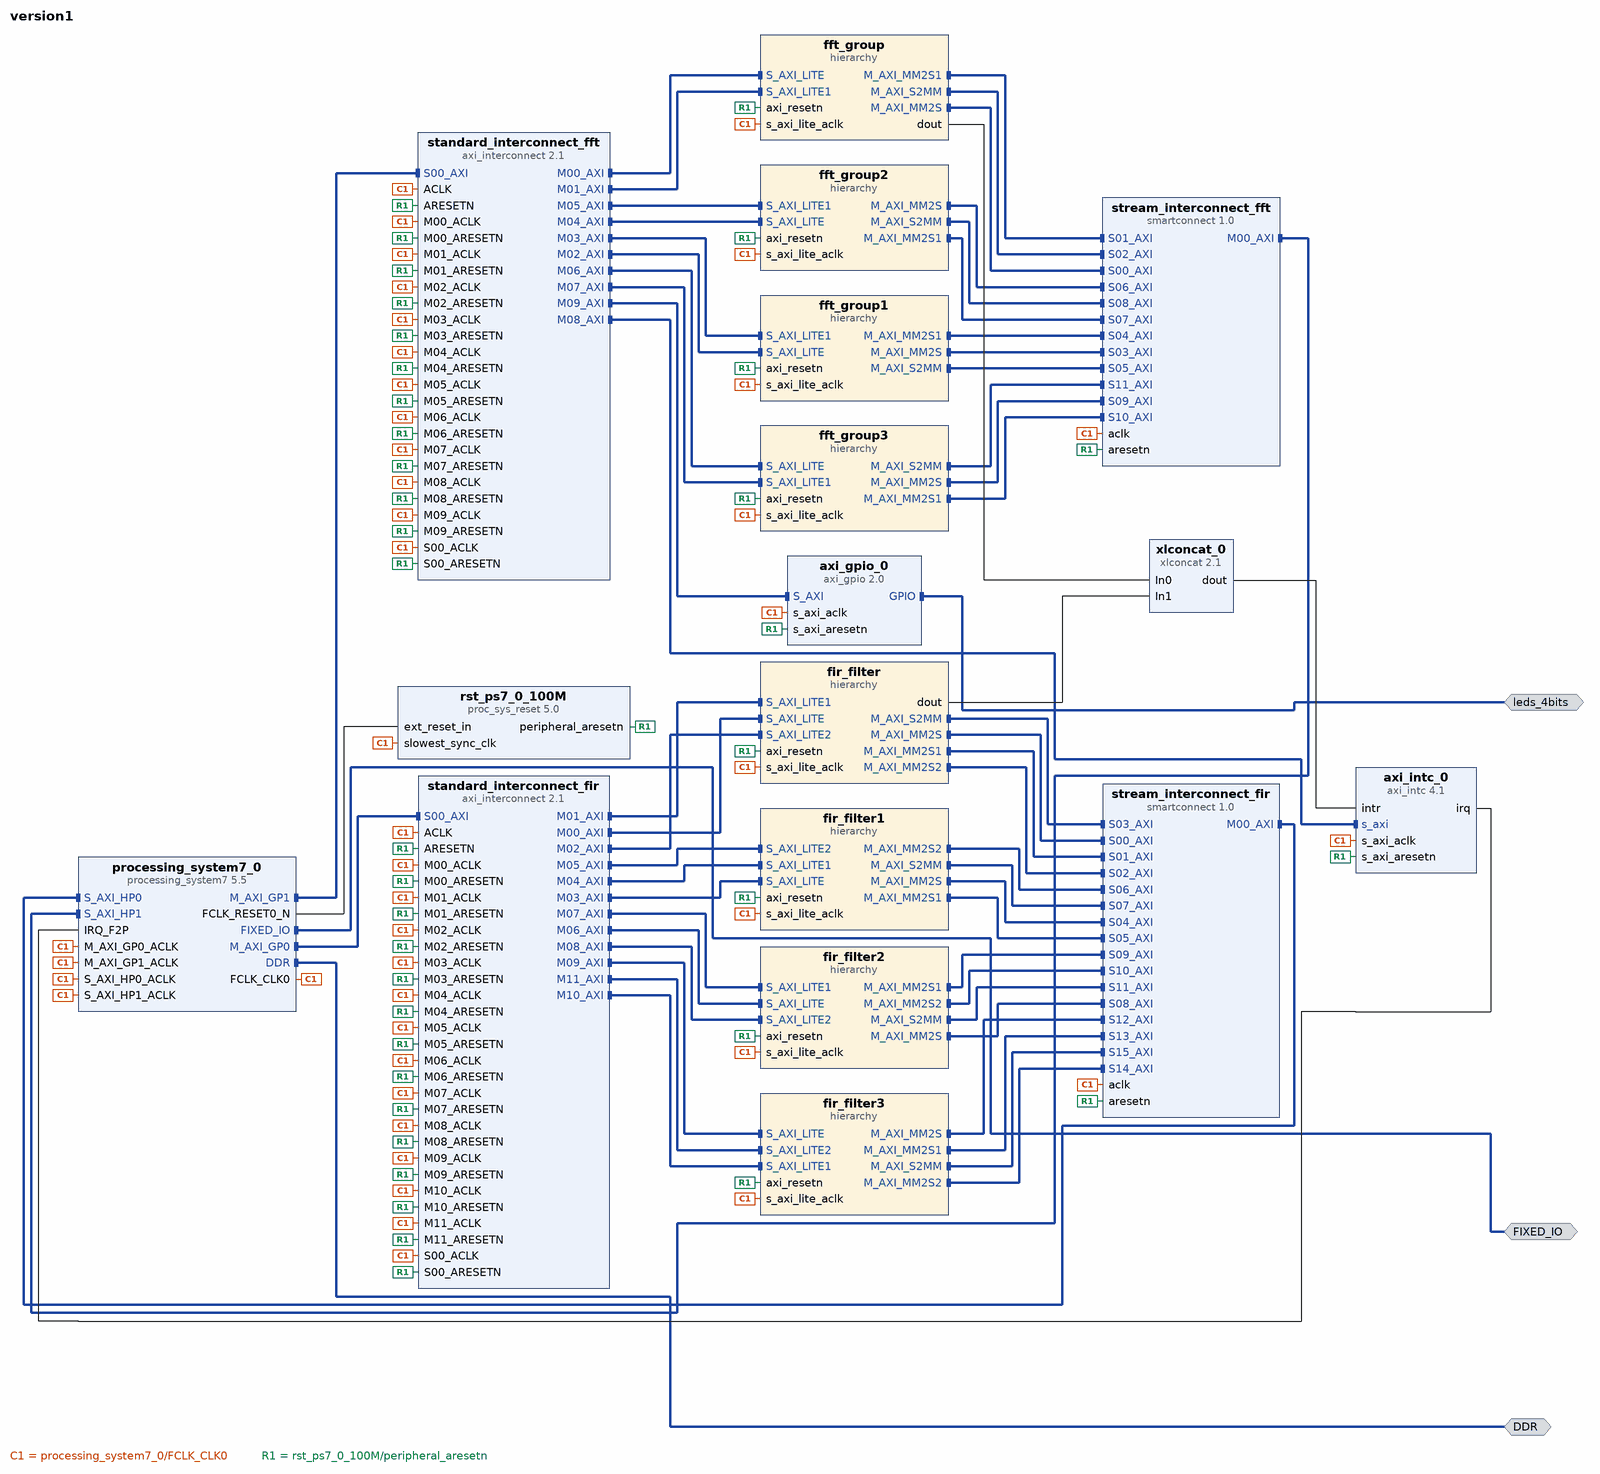
[diagram p0: block diagram of the top level]
# Vivado block design version1, xc7z020clg400-1, Vivado 2019.1
create_bd_design version1

create_bd_intf_port -mode Master -vlnv xilinx.com:interface:ddrx_rtl:1.0 DDR
create_bd_intf_port -mode Master -vlnv xilinx.com:display_processing_system7:fixedio_rtl:1.0 FIXED_IO
create_bd_intf_port -mode Master -vlnv xilinx.com:interface:gpio_rtl:1.0 leds_4bits

create_bd_cell -type ip -vlnv xilinx.com:ip:axi_gpio:2.0 axi_gpio_0
set_property -dict [list \
  CONFIG.C_IS_DUAL 0 \
  CONFIG.GPIO_BOARD_INTERFACE leds_4bits \
  CONFIG.USE_BOARD_FLOW true \
] [get_bd_cells axi_gpio_0]
create_bd_cell -type ip -vlnv xilinx.com:ip:axi_intc:4.1 axi_intc_0
create_bd_cell -type hier fft_group
create_bd_cell -type hier fir_filter
create_bd_cell -type ip -vlnv xilinx.com:ip:processing_system7:5.5 processing_system7_0
set_property -dict [list \
  CONFIG.PCW_APU_PERIPHERAL_FREQMHZ 650 \
  CONFIG.PCW_CRYSTAL_PERIPHERAL_FREQMHZ 50 \
  CONFIG.PCW_ENET0_ENET0_IO {MIO 16 .. 27} \
  CONFIG.PCW_ENET0_GRP_MDIO_ENABLE 1 \
  CONFIG.PCW_ENET0_GRP_MDIO_IO {MIO 52 .. 53} \
  CONFIG.PCW_ENET0_PERIPHERAL_ENABLE 1 \
  CONFIG.PCW_ENET0_RESET_ENABLE 1 \
  CONFIG.PCW_ENET0_RESET_IO {MIO 9} \
  CONFIG.PCW_ENET_RESET_ENABLE 1 \
  CONFIG.PCW_ENET_RESET_SELECT {Share reset pin} \
  CONFIG.PCW_FPGA0_PERIPHERAL_FREQMHZ 100 \
  CONFIG.PCW_FPGA1_PERIPHERAL_FREQMHZ 50 \
  CONFIG.PCW_GPIO_MIO_GPIO_ENABLE 1 \
  CONFIG.PCW_GPIO_MIO_GPIO_IO MIO \
  CONFIG.PCW_I2C_RESET_ENABLE 1 \
  CONFIG.PCW_IRQ_F2P_INTR 1 \
  CONFIG.PCW_PERIPHERAL_BOARD_PRESET part0 \
  CONFIG.PCW_PRESET_BANK1_VOLTAGE {LVCMOS 1.8V} \
  CONFIG.PCW_QSPI_GRP_FBCLK_ENABLE 1 \
  CONFIG.PCW_QSPI_GRP_FBCLK_IO {MIO 8} \
  CONFIG.PCW_QSPI_GRP_SINGLE_SS_ENABLE 1 \
  CONFIG.PCW_QSPI_GRP_SINGLE_SS_IO {MIO 1 .. 6} \
  CONFIG.PCW_QSPI_PERIPHERAL_ENABLE 1 \
  CONFIG.PCW_QSPI_QSPI_IO {MIO 1 .. 6} \
  CONFIG.PCW_SD0_GRP_CD_ENABLE 1 \
  CONFIG.PCW_SD0_GRP_CD_IO {MIO 47} \
  CONFIG.PCW_SD0_GRP_WP_ENABLE 0 \
  CONFIG.PCW_SD0_PERIPHERAL_ENABLE 1 \
  CONFIG.PCW_SD0_SD0_IO {MIO 40 .. 45} \
  CONFIG.PCW_SDIO_PERIPHERAL_FREQMHZ 50 \
  CONFIG.PCW_SINGLE_QSPI_DATA_MODE x4 \
  CONFIG.PCW_UART0_PERIPHERAL_ENABLE 1 \
  CONFIG.PCW_UART0_UART0_IO {MIO 14 .. 15} \
  CONFIG.PCW_UART1_PERIPHERAL_ENABLE 0 \
  CONFIG.PCW_UART_PERIPHERAL_FREQMHZ 100 \
  CONFIG.PCW_UIPARAM_DDR_BUS_WIDTH {16 Bit} \
  CONFIG.PCW_UIPARAM_DDR_FREQ_MHZ 525 \
  CONFIG.PCW_UIPARAM_DDR_PARTNO {MT41J256M16 RE-125} \
  CONFIG.PCW_USB0_PERIPHERAL_ENABLE 1 \
  CONFIG.PCW_USB0_RESET_ENABLE 1 \
  CONFIG.PCW_USB0_RESET_IO {MIO 46} \
  CONFIG.PCW_USB0_USB0_IO {MIO 28 .. 39} \
  CONFIG.PCW_USB_RESET_ENABLE 1 \
  CONFIG.PCW_USB_RESET_SELECT {Share reset pin} \
  CONFIG.PCW_USE_FABRIC_INTERRUPT 1 \
  CONFIG.PCW_USE_M_AXI_GP1 1 \
  CONFIG.PCW_USE_S_AXI_HP0 1 \
  CONFIG.PCW_USE_S_AXI_HP1 1 \
] [get_bd_cells processing_system7_0]
# 506 more settings of processing_system7_0 are not shown: defaults, MIO pin electricals, DDR timing, and values the tool derives
create_bd_cell -type ip -vlnv xilinx.com:ip:proc_sys_reset:5.0 rst_ps7_0_100M
create_bd_cell -type ip -vlnv xilinx.com:ip:axi_interconnect:2.1 standard_interconnect_fir
set_property -dict {CONFIG.NUM_MI 12} [get_bd_cells standard_interconnect_fir]
create_bd_cell -type ip -vlnv xilinx.com:ip:smartconnect:1.0 stream_interconnect_fir
set_property -dict {CONFIG.NUM_SI 16} [get_bd_cells stream_interconnect_fir]
create_bd_cell -type ip -vlnv xilinx.com:ip:xlconcat:2.1 xlconcat_0
create_bd_cell -type hier fft_group1
create_bd_cell -type hier fir_filter1
create_bd_cell -type hier fft_group2
create_bd_cell -type hier fir_filter2
create_bd_cell -type hier fft_group3
create_bd_cell -type hier fir_filter3
create_bd_cell -type ip -vlnv xilinx.com:ip:axi_interconnect:2.1 standard_interconnect_fft
set_property -dict {CONFIG.NUM_MI 10} [get_bd_cells standard_interconnect_fft]
create_bd_cell -type ip -vlnv xilinx.com:ip:smartconnect:1.0 stream_interconnect_fft
set_property -dict {CONFIG.NUM_SI 12} [get_bd_cells stream_interconnect_fft]

# ---- hierarchy /fft_group ----
current_bd_instance /fft_group
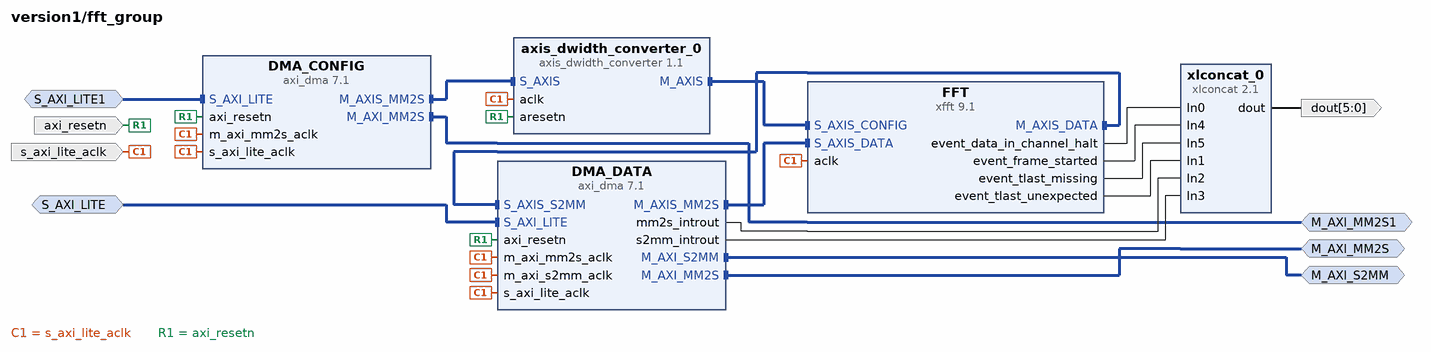
[diagram p1: block diagram inside /fft_group]
create_bd_intf_pin -mode Master -vlnv xilinx.com:interface:aximm_rtl:1.0 M_AXI_MM2S
create_bd_intf_pin -mode Master -vlnv xilinx.com:interface:aximm_rtl:1.0 M_AXI_MM2S1
create_bd_intf_pin -mode Master -vlnv xilinx.com:interface:aximm_rtl:1.0 M_AXI_S2MM
create_bd_intf_pin -mode Slave -vlnv xilinx.com:interface:aximm_rtl:1.0 S_AXI_LITE
create_bd_intf_pin -mode Slave -vlnv xilinx.com:interface:aximm_rtl:1.0 S_AXI_LITE1
create_bd_pin -dir I -type rst axi_resetn
create_bd_pin -dir O -from 5 -to 0 dout
create_bd_pin -dir I -type clk s_axi_lite_aclk

create_bd_cell -type ip -vlnv xilinx.com:ip:axi_dma:7.1 DMA_CONFIG
set_property -dict [list \
  CONFIG.c_include_mm2s 1 \
  CONFIG.c_include_s2mm 0 \
  CONFIG.c_include_sg 0 \
  CONFIG.c_m_axis_mm2s_tdata_width 32 \
  CONFIG.c_micro_dma 0 \
  CONFIG.c_mm2s_burst_size 32 \
  CONFIG.c_sg_length_width 14 \
] [get_bd_cells DMA_CONFIG]
create_bd_cell -type ip -vlnv xilinx.com:ip:axi_dma:7.1 DMA_DATA
set_property -dict [list \
  CONFIG.c_include_mm2s 1 \
  CONFIG.c_include_sg 0 \
  CONFIG.c_m_axi_mm2s_data_width 64 \
  CONFIG.c_m_axis_mm2s_tdata_width 64 \
  CONFIG.c_mm2s_burst_size 8 \
  CONFIG.c_sg_length_width 14 \
] [get_bd_cells DMA_DATA]
create_bd_cell -type ip -vlnv xilinx.com:ip:xfft:9.1 FFT
set_property -dict [list \
  CONFIG.butterfly_type use_xtremedsp_slices \
  CONFIG.channels 1 \
  CONFIG.complex_mult_type use_mults_resources \
  CONFIG.cyclic_prefix_insertion false \
  CONFIG.data_format fixed_point \
  CONFIG.implementation_options radix_4_burst_io \
  CONFIG.input_width 32 \
  CONFIG.number_of_stages_using_block_ram_for_data_and_phase_factors 0 \
  CONFIG.output_ordering natural_order \
  CONFIG.run_time_configurable_transform_length true \
  CONFIG.target_clock_frequency 100 \
  CONFIG.target_data_throughput 50 \
  CONFIG.throttle_scheme nonrealtime \
  CONFIG.transform_length 2048 \
] [get_bd_cells FFT]
create_bd_cell -type ip -vlnv xilinx.com:ip:axis_dwidth_converter:1.1 axis_dwidth_converter_0
set_property -dict {CONFIG.M_TDATA_NUM_BYTES 3} [get_bd_cells axis_dwidth_converter_0]
create_bd_cell -type ip -vlnv xilinx.com:ip:xlconcat:2.1 xlconcat_0
set_property -dict {CONFIG.NUM_PORTS 6} [get_bd_cells xlconcat_0]

# ---- hierarchy /fir_filter ----
current_bd_instance /fir_filter
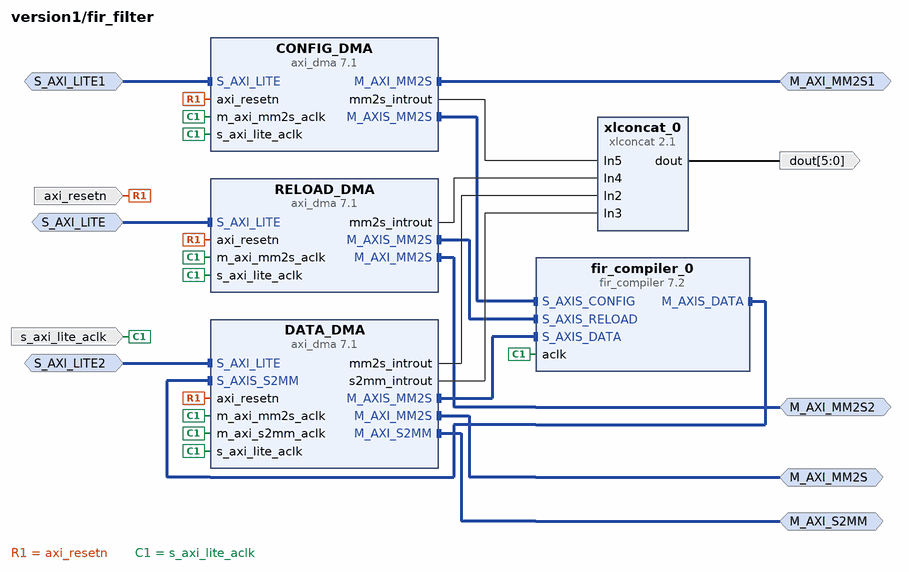
[diagram p2: block diagram inside /fir_filter]
create_bd_intf_pin -mode Master -vlnv xilinx.com:interface:aximm_rtl:1.0 M_AXI_MM2S
create_bd_intf_pin -mode Master -vlnv xilinx.com:interface:aximm_rtl:1.0 M_AXI_MM2S1
create_bd_intf_pin -mode Master -vlnv xilinx.com:interface:aximm_rtl:1.0 M_AXI_MM2S2
create_bd_intf_pin -mode Master -vlnv xilinx.com:interface:aximm_rtl:1.0 M_AXI_S2MM
create_bd_intf_pin -mode Slave -vlnv xilinx.com:interface:aximm_rtl:1.0 S_AXI_LITE
create_bd_intf_pin -mode Slave -vlnv xilinx.com:interface:aximm_rtl:1.0 S_AXI_LITE1
create_bd_intf_pin -mode Slave -vlnv xilinx.com:interface:aximm_rtl:1.0 S_AXI_LITE2
create_bd_pin -dir I -type rst axi_resetn
create_bd_pin -dir O -from 5 -to 0 dout
create_bd_pin -dir I -type clk s_axi_lite_aclk

create_bd_cell -type ip -vlnv xilinx.com:ip:axi_dma:7.1 CONFIG_DMA
set_property -dict [list \
  CONFIG.c_include_mm2s 1 \
  CONFIG.c_include_s2mm 0 \
  CONFIG.c_include_sg 0 \
  CONFIG.c_m_axis_mm2s_tdata_width 8 \
] [get_bd_cells CONFIG_DMA]
create_bd_cell -type ip -vlnv xilinx.com:ip:axi_dma:7.1 DATA_DMA
set_property -dict [list \
  CONFIG.c_include_mm2s 1 \
  CONFIG.c_include_sg 0 \
  CONFIG.c_m_axi_mm2s_data_width 32 \
  CONFIG.c_m_axis_mm2s_tdata_width 32 \
  CONFIG.c_mm2s_burst_size 16 \
  CONFIG.c_sg_length_width 26 \
] [get_bd_cells DATA_DMA]
create_bd_cell -type ip -vlnv xilinx.com:ip:axi_dma:7.1 RELOAD_DMA
set_property -dict [list \
  CONFIG.c_include_mm2s 1 \
  CONFIG.c_include_s2mm 0 \
  CONFIG.c_include_sg 0 \
  CONFIG.c_m_axis_mm2s_tdata_width 16 \
] [get_bd_cells RELOAD_DMA]
create_bd_cell -type ip -vlnv xilinx.com:ip:fir_compiler:7.2 fir_compiler_0
set_property -dict [list \
  CONFIG.Clock_Frequency 100 \
  CONFIG.CoefficientVector {-169, -314, -507, -43, 807, 1195, 677, -195, -495, -126, 121, -191, -539, -376, -17, -46, -324, -285, 63, 172, -57, -117, 178, 359, 157, -9, 203, 422, 240, -35, 70, 314, 172, -189, -195, 83, 33, -364, -463, -133, -27, -391, -570, -188, 119, -159, -428, -45, 457, 287, -122, 154, 798, 734, 114, 141, 851, 914, 38, -332, 392, 684, -421, -1332, -601, 190, -1023, -2736, -2002, -15, -1039, -4748, -4549, 3141, 11762, 11762, 3141, -4549, -4748, -1039, -15, -2002, -2736, -1023, 190, -601, -1332, -421, 684, 392, -332, 38, 914, 851, 141, 114, 734, 798, 154, -122, 287, 457, -45, -428, -159, 119, -188, -570, -391, -27, -133, -463, -364, 33, 83, -195, -189, 172, 314, 70, -35, 240, 422, 203, -9, 157, 359, 178, -117, -57, 172, 63, -285, -324, -46, -17, -376, -539, -191, 121, -126, -495, -195, 677, 1195, 807, -43, -507, -314, -169} \
  CONFIG.Coefficient_Fractional_Bits 0 \
  CONFIG.Coefficient_Reload true \
  CONFIG.Coefficient_Sets 1 \
  CONFIG.Coefficient_Sign Signed \
  CONFIG.Coefficient_Structure Inferred \
  CONFIG.Coefficient_Width 16 \
  CONFIG.ColumnConfig 1 \
  CONFIG.DATA_Has_TLAST Packet_Framing \
  CONFIG.Data_Fractional_Bits 0 \
  CONFIG.Data_Width 32 \
  CONFIG.DisplayReloadOrder true \
  CONFIG.Filter_Architecture Systolic_Multiply_Accumulate \
  CONFIG.Gen_MIF_from_COE false \
  CONFIG.Gen_MIF_from_Spec false \
  CONFIG.Has_ARESETn true \
  CONFIG.M_DATA_Has_TREADY true \
  CONFIG.Output_Rounding_Mode Non_Symmetric_Rounding_Up \
  CONFIG.Output_Width 32 \
  CONFIG.Passband_Max 0.7 \
  CONFIG.Quantization Integer_Coefficients \
  CONFIG.Sample_Frequency 1.28E-4 \
  CONFIG.Stopband_Max .7 \
  CONFIG.Stopband_Min 0.3 \
] [get_bd_cells fir_compiler_0]
create_bd_cell -type ip -vlnv xilinx.com:ip:xlconcat:2.1 xlconcat_0
set_property -dict {CONFIG.NUM_PORTS 6} [get_bd_cells xlconcat_0]

# ---- hierarchy /fft_group1 ----
current_bd_instance /fft_group1
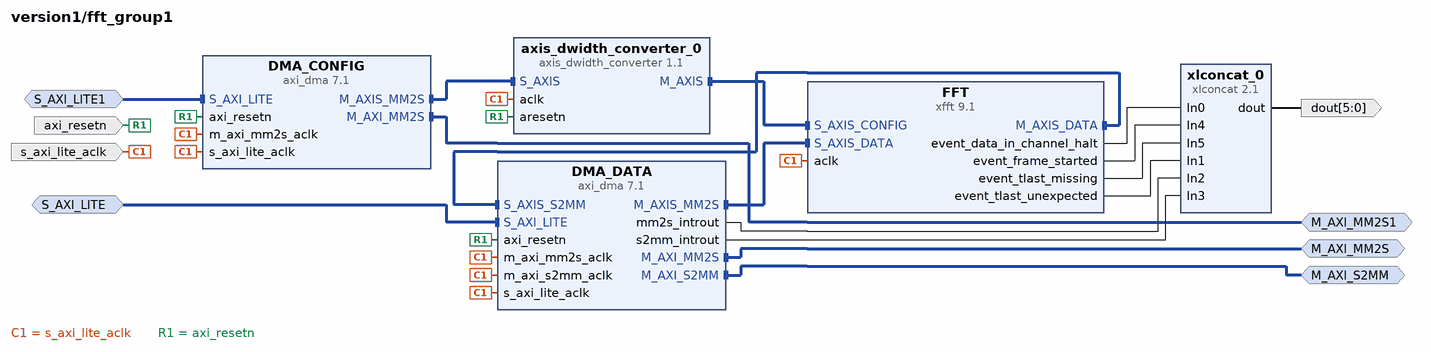
[diagram p3: block diagram inside /fft_group1]
create_bd_intf_pin -mode Master -vlnv xilinx.com:interface:aximm_rtl:1.0 M_AXI_MM2S
create_bd_intf_pin -mode Master -vlnv xilinx.com:interface:aximm_rtl:1.0 M_AXI_MM2S1
create_bd_intf_pin -mode Master -vlnv xilinx.com:interface:aximm_rtl:1.0 M_AXI_S2MM
create_bd_intf_pin -mode Slave -vlnv xilinx.com:interface:aximm_rtl:1.0 S_AXI_LITE
create_bd_intf_pin -mode Slave -vlnv xilinx.com:interface:aximm_rtl:1.0 S_AXI_LITE1
create_bd_pin -dir I -type rst axi_resetn
create_bd_pin -dir O -from 5 -to 0 dout
create_bd_pin -dir I -type clk s_axi_lite_aclk

create_bd_cell -type ip -vlnv xilinx.com:ip:axi_dma:7.1 DMA_CONFIG
set_property -dict [list \
  CONFIG.c_include_mm2s 1 \
  CONFIG.c_include_s2mm 0 \
  CONFIG.c_include_sg 0 \
  CONFIG.c_m_axis_mm2s_tdata_width 32 \
  CONFIG.c_micro_dma 0 \
  CONFIG.c_mm2s_burst_size 32 \
  CONFIG.c_sg_length_width 8 \
] [get_bd_cells DMA_CONFIG]
create_bd_cell -type ip -vlnv xilinx.com:ip:axi_dma:7.1 DMA_DATA
set_property -dict [list \
  CONFIG.c_include_mm2s 1 \
  CONFIG.c_include_sg 0 \
  CONFIG.c_m_axi_mm2s_data_width 64 \
  CONFIG.c_m_axis_mm2s_tdata_width 64 \
  CONFIG.c_mm2s_burst_size 8 \
  CONFIG.c_sg_length_width 14 \
] [get_bd_cells DMA_DATA]
create_bd_cell -type ip -vlnv xilinx.com:ip:xfft:9.1 FFT
set_property -dict [list \
  CONFIG.butterfly_type use_xtremedsp_slices \
  CONFIG.channels 1 \
  CONFIG.complex_mult_type use_mults_resources \
  CONFIG.cyclic_prefix_insertion false \
  CONFIG.data_format fixed_point \
  CONFIG.implementation_options radix_4_burst_io \
  CONFIG.input_width 32 \
  CONFIG.number_of_stages_using_block_ram_for_data_and_phase_factors 0 \
  CONFIG.output_ordering natural_order \
  CONFIG.run_time_configurable_transform_length true \
  CONFIG.target_clock_frequency 100 \
  CONFIG.target_data_throughput 50 \
  CONFIG.throttle_scheme nonrealtime \
  CONFIG.transform_length 2048 \
] [get_bd_cells FFT]
create_bd_cell -type ip -vlnv xilinx.com:ip:axis_dwidth_converter:1.1 axis_dwidth_converter_0
set_property -dict {CONFIG.M_TDATA_NUM_BYTES 3} [get_bd_cells axis_dwidth_converter_0]
create_bd_cell -type ip -vlnv xilinx.com:ip:xlconcat:2.1 xlconcat_0
set_property -dict {CONFIG.NUM_PORTS 6} [get_bd_cells xlconcat_0]

# ---- hierarchy /fir_filter1 ----
current_bd_instance /fir_filter1
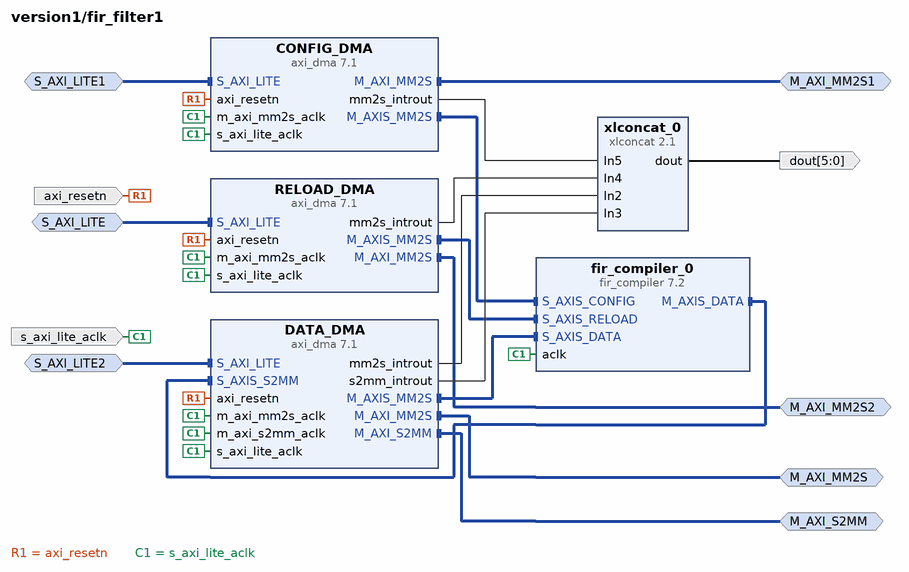
[diagram p4: block diagram inside /fir_filter1]
create_bd_intf_pin -mode Master -vlnv xilinx.com:interface:aximm_rtl:1.0 M_AXI_MM2S
create_bd_intf_pin -mode Master -vlnv xilinx.com:interface:aximm_rtl:1.0 M_AXI_MM2S1
create_bd_intf_pin -mode Master -vlnv xilinx.com:interface:aximm_rtl:1.0 M_AXI_MM2S2
create_bd_intf_pin -mode Master -vlnv xilinx.com:interface:aximm_rtl:1.0 M_AXI_S2MM
create_bd_intf_pin -mode Slave -vlnv xilinx.com:interface:aximm_rtl:1.0 S_AXI_LITE
create_bd_intf_pin -mode Slave -vlnv xilinx.com:interface:aximm_rtl:1.0 S_AXI_LITE1
create_bd_intf_pin -mode Slave -vlnv xilinx.com:interface:aximm_rtl:1.0 S_AXI_LITE2
create_bd_pin -dir I -type rst axi_resetn
create_bd_pin -dir O -from 5 -to 0 dout
create_bd_pin -dir I -type clk s_axi_lite_aclk

create_bd_cell -type ip -vlnv xilinx.com:ip:axi_dma:7.1 CONFIG_DMA
set_property -dict [list \
  CONFIG.c_include_mm2s 1 \
  CONFIG.c_include_s2mm 0 \
  CONFIG.c_include_sg 0 \
  CONFIG.c_m_axis_mm2s_tdata_width 8 \
] [get_bd_cells CONFIG_DMA]
create_bd_cell -type ip -vlnv xilinx.com:ip:axi_dma:7.1 DATA_DMA
set_property -dict [list \
  CONFIG.c_include_mm2s 1 \
  CONFIG.c_include_sg 0 \
  CONFIG.c_m_axi_mm2s_data_width 32 \
  CONFIG.c_m_axis_mm2s_tdata_width 32 \
  CONFIG.c_mm2s_burst_size 16 \
  CONFIG.c_sg_length_width 26 \
] [get_bd_cells DATA_DMA]
create_bd_cell -type ip -vlnv xilinx.com:ip:axi_dma:7.1 RELOAD_DMA
set_property -dict [list \
  CONFIG.c_include_mm2s 1 \
  CONFIG.c_include_s2mm 0 \
  CONFIG.c_include_sg 0 \
  CONFIG.c_m_axis_mm2s_tdata_width 16 \
] [get_bd_cells RELOAD_DMA]
create_bd_cell -type ip -vlnv xilinx.com:ip:fir_compiler:7.2 fir_compiler_0
set_property -dict [list \
  CONFIG.Clock_Frequency 100 \
  CONFIG.CoefficientVector {-169, -314, -507, -43, 807, 1195, 677, -195, -495, -126, 121, -191, -539, -376, -17, -46, -324, -285, 63, 172, -57, -117, 178, 359, 157, -9, 203, 422, 240, -35, 70, 314, 172, -189, -195, 83, 33, -364, -463, -133, -27, -391, -570, -188, 119, -159, -428, -45, 457, 287, -122, 154, 798, 734, 114, 141, 851, 914, 38, -332, 392, 684, -421, -1332, -601, 190, -1023, -2736, -2002, -15, -1039, -4748, -4549, 3141, 11762, 11762, 3141, -4549, -4748, -1039, -15, -2002, -2736, -1023, 190, -601, -1332, -421, 684, 392, -332, 38, 914, 851, 141, 114, 734, 798, 154, -122, 287, 457, -45, -428, -159, 119, -188, -570, -391, -27, -133, -463, -364, 33, 83, -195, -189, 172, 314, 70, -35, 240, 422, 203, -9, 157, 359, 178, -117, -57, 172, 63, -285, -324, -46, -17, -376, -539, -191, 121, -126, -495, -195, 677, 1195, 807, -43, -507, -314, -169} \
  CONFIG.Coefficient_Fractional_Bits 0 \
  CONFIG.Coefficient_Reload true \
  CONFIG.Coefficient_Sets 1 \
  CONFIG.Coefficient_Sign Signed \
  CONFIG.Coefficient_Structure Inferred \
  CONFIG.Coefficient_Width 16 \
  CONFIG.ColumnConfig 1 \
  CONFIG.DATA_Has_TLAST Packet_Framing \
  CONFIG.Data_Fractional_Bits 0 \
  CONFIG.Data_Width 32 \
  CONFIG.DisplayReloadOrder true \
  CONFIG.Filter_Architecture Systolic_Multiply_Accumulate \
  CONFIG.Gen_MIF_from_COE false \
  CONFIG.Gen_MIF_from_Spec false \
  CONFIG.Has_ARESETn true \
  CONFIG.M_DATA_Has_TREADY true \
  CONFIG.Output_Rounding_Mode Non_Symmetric_Rounding_Up \
  CONFIG.Output_Width 32 \
  CONFIG.Passband_Max 0.7 \
  CONFIG.Quantization Integer_Coefficients \
  CONFIG.Sample_Frequency 1.28E-4 \
  CONFIG.Stopband_Max .7 \
  CONFIG.Stopband_Min 0.3 \
] [get_bd_cells fir_compiler_0]
create_bd_cell -type ip -vlnv xilinx.com:ip:xlconcat:2.1 xlconcat_0
set_property -dict {CONFIG.NUM_PORTS 6} [get_bd_cells xlconcat_0]

# ---- hierarchy /fft_group2 ----
current_bd_instance /fft_group2
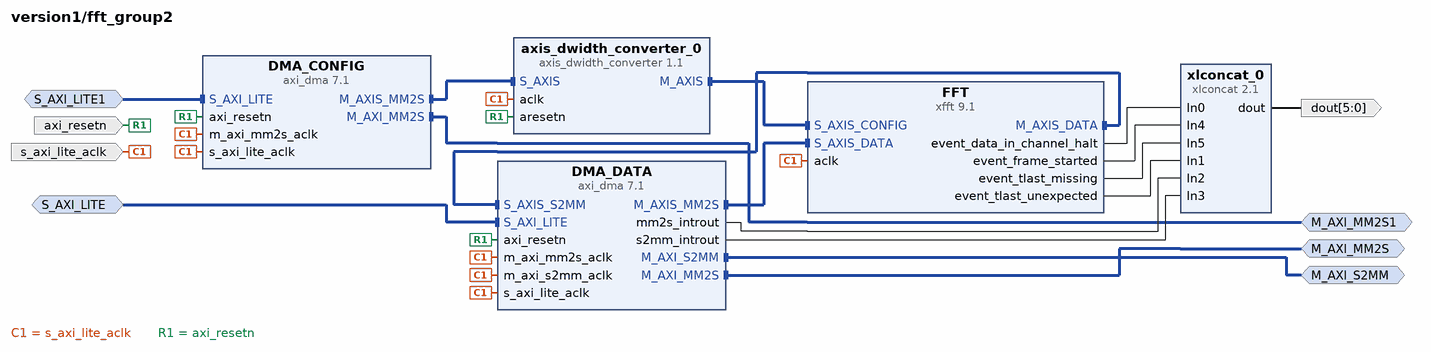
[diagram p5: block diagram inside /fft_group2]
create_bd_intf_pin -mode Master -vlnv xilinx.com:interface:aximm_rtl:1.0 M_AXI_MM2S
create_bd_intf_pin -mode Master -vlnv xilinx.com:interface:aximm_rtl:1.0 M_AXI_MM2S1
create_bd_intf_pin -mode Master -vlnv xilinx.com:interface:aximm_rtl:1.0 M_AXI_S2MM
create_bd_intf_pin -mode Slave -vlnv xilinx.com:interface:aximm_rtl:1.0 S_AXI_LITE
create_bd_intf_pin -mode Slave -vlnv xilinx.com:interface:aximm_rtl:1.0 S_AXI_LITE1
create_bd_pin -dir I -type rst axi_resetn
create_bd_pin -dir O -from 5 -to 0 dout
create_bd_pin -dir I -type clk s_axi_lite_aclk

create_bd_cell -type ip -vlnv xilinx.com:ip:axi_dma:7.1 DMA_CONFIG
set_property -dict [list \
  CONFIG.c_include_mm2s 1 \
  CONFIG.c_include_s2mm 0 \
  CONFIG.c_include_sg 0 \
  CONFIG.c_m_axis_mm2s_tdata_width 32 \
  CONFIG.c_micro_dma 0 \
  CONFIG.c_mm2s_burst_size 32 \
  CONFIG.c_sg_length_width 8 \
] [get_bd_cells DMA_CONFIG]
create_bd_cell -type ip -vlnv xilinx.com:ip:axi_dma:7.1 DMA_DATA
set_property -dict [list \
  CONFIG.c_include_mm2s 1 \
  CONFIG.c_include_sg 0 \
  CONFIG.c_m_axi_mm2s_data_width 64 \
  CONFIG.c_m_axis_mm2s_tdata_width 64 \
  CONFIG.c_mm2s_burst_size 8 \
  CONFIG.c_sg_length_width 14 \
] [get_bd_cells DMA_DATA]
create_bd_cell -type ip -vlnv xilinx.com:ip:xfft:9.1 FFT
set_property -dict [list \
  CONFIG.butterfly_type use_xtremedsp_slices \
  CONFIG.channels 1 \
  CONFIG.complex_mult_type use_mults_resources \
  CONFIG.cyclic_prefix_insertion false \
  CONFIG.data_format fixed_point \
  CONFIG.implementation_options radix_4_burst_io \
  CONFIG.input_width 32 \
  CONFIG.number_of_stages_using_block_ram_for_data_and_phase_factors 0 \
  CONFIG.output_ordering natural_order \
  CONFIG.run_time_configurable_transform_length true \
  CONFIG.target_clock_frequency 100 \
  CONFIG.target_data_throughput 50 \
  CONFIG.throttle_scheme nonrealtime \
  CONFIG.transform_length 2048 \
] [get_bd_cells FFT]
create_bd_cell -type ip -vlnv xilinx.com:ip:axis_dwidth_converter:1.1 axis_dwidth_converter_0
set_property -dict {CONFIG.M_TDATA_NUM_BYTES 3} [get_bd_cells axis_dwidth_converter_0]
create_bd_cell -type ip -vlnv xilinx.com:ip:xlconcat:2.1 xlconcat_0
set_property -dict {CONFIG.NUM_PORTS 6} [get_bd_cells xlconcat_0]

# ---- hierarchy /fir_filter2 ----
current_bd_instance /fir_filter2
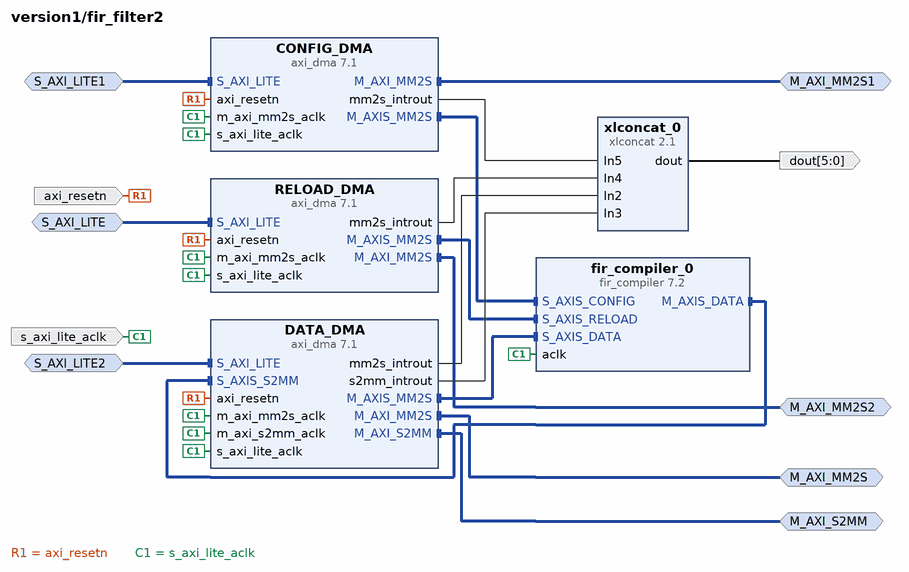
[diagram p6: block diagram inside /fir_filter2]
create_bd_intf_pin -mode Master -vlnv xilinx.com:interface:aximm_rtl:1.0 M_AXI_MM2S
create_bd_intf_pin -mode Master -vlnv xilinx.com:interface:aximm_rtl:1.0 M_AXI_MM2S1
create_bd_intf_pin -mode Master -vlnv xilinx.com:interface:aximm_rtl:1.0 M_AXI_MM2S2
create_bd_intf_pin -mode Master -vlnv xilinx.com:interface:aximm_rtl:1.0 M_AXI_S2MM
create_bd_intf_pin -mode Slave -vlnv xilinx.com:interface:aximm_rtl:1.0 S_AXI_LITE
create_bd_intf_pin -mode Slave -vlnv xilinx.com:interface:aximm_rtl:1.0 S_AXI_LITE1
create_bd_intf_pin -mode Slave -vlnv xilinx.com:interface:aximm_rtl:1.0 S_AXI_LITE2
create_bd_pin -dir I -type rst axi_resetn
create_bd_pin -dir O -from 5 -to 0 dout
create_bd_pin -dir I -type clk s_axi_lite_aclk

create_bd_cell -type ip -vlnv xilinx.com:ip:axi_dma:7.1 CONFIG_DMA
set_property -dict [list \
  CONFIG.c_include_mm2s 1 \
  CONFIG.c_include_s2mm 0 \
  CONFIG.c_include_sg 0 \
  CONFIG.c_m_axis_mm2s_tdata_width 8 \
] [get_bd_cells CONFIG_DMA]
create_bd_cell -type ip -vlnv xilinx.com:ip:axi_dma:7.1 DATA_DMA
set_property -dict [list \
  CONFIG.c_include_mm2s 1 \
  CONFIG.c_include_sg 0 \
  CONFIG.c_m_axi_mm2s_data_width 32 \
  CONFIG.c_m_axis_mm2s_tdata_width 32 \
  CONFIG.c_mm2s_burst_size 16 \
  CONFIG.c_sg_length_width 26 \
] [get_bd_cells DATA_DMA]
create_bd_cell -type ip -vlnv xilinx.com:ip:axi_dma:7.1 RELOAD_DMA
set_property -dict [list \
  CONFIG.c_include_mm2s 1 \
  CONFIG.c_include_s2mm 0 \
  CONFIG.c_include_sg 0 \
  CONFIG.c_m_axis_mm2s_tdata_width 16 \
] [get_bd_cells RELOAD_DMA]
create_bd_cell -type ip -vlnv xilinx.com:ip:fir_compiler:7.2 fir_compiler_0
set_property -dict [list \
  CONFIG.Clock_Frequency 100 \
  CONFIG.CoefficientVector {-169, -314, -507, -43, 807, 1195, 677, -195, -495, -126, 121, -191, -539, -376, -17, -46, -324, -285, 63, 172, -57, -117, 178, 359, 157, -9, 203, 422, 240, -35, 70, 314, 172, -189, -195, 83, 33, -364, -463, -133, -27, -391, -570, -188, 119, -159, -428, -45, 457, 287, -122, 154, 798, 734, 114, 141, 851, 914, 38, -332, 392, 684, -421, -1332, -601, 190, -1023, -2736, -2002, -15, -1039, -4748, -4549, 3141, 11762, 11762, 3141, -4549, -4748, -1039, -15, -2002, -2736, -1023, 190, -601, -1332, -421, 684, 392, -332, 38, 914, 851, 141, 114, 734, 798, 154, -122, 287, 457, -45, -428, -159, 119, -188, -570, -391, -27, -133, -463, -364, 33, 83, -195, -189, 172, 314, 70, -35, 240, 422, 203, -9, 157, 359, 178, -117, -57, 172, 63, -285, -324, -46, -17, -376, -539, -191, 121, -126, -495, -195, 677, 1195, 807, -43, -507, -314, -169} \
  CONFIG.Coefficient_Fractional_Bits 0 \
  CONFIG.Coefficient_Reload true \
  CONFIG.Coefficient_Sets 1 \
  CONFIG.Coefficient_Sign Signed \
  CONFIG.Coefficient_Structure Inferred \
  CONFIG.Coefficient_Width 16 \
  CONFIG.ColumnConfig 1 \
  CONFIG.DATA_Has_TLAST Packet_Framing \
  CONFIG.Data_Fractional_Bits 0 \
  CONFIG.Data_Width 32 \
  CONFIG.DisplayReloadOrder true \
  CONFIG.Filter_Architecture Systolic_Multiply_Accumulate \
  CONFIG.Gen_MIF_from_COE false \
  CONFIG.Gen_MIF_from_Spec false \
  CONFIG.Has_ARESETn true \
  CONFIG.M_DATA_Has_TREADY true \
  CONFIG.Output_Rounding_Mode Non_Symmetric_Rounding_Up \
  CONFIG.Output_Width 32 \
  CONFIG.Passband_Max 0.7 \
  CONFIG.Quantization Integer_Coefficients \
  CONFIG.Sample_Frequency 1.28E-4 \
  CONFIG.Stopband_Max .7 \
  CONFIG.Stopband_Min 0.3 \
] [get_bd_cells fir_compiler_0]
create_bd_cell -type ip -vlnv xilinx.com:ip:xlconcat:2.1 xlconcat_0
set_property -dict {CONFIG.NUM_PORTS 6} [get_bd_cells xlconcat_0]

# ---- hierarchy /fft_group3 ----
current_bd_instance /fft_group3
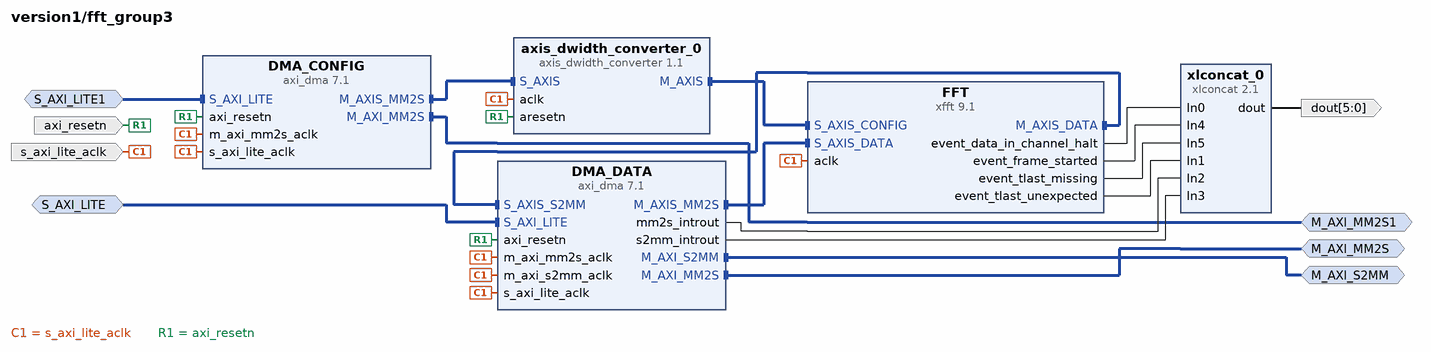
[diagram p7: block diagram inside /fft_group3]
create_bd_intf_pin -mode Master -vlnv xilinx.com:interface:aximm_rtl:1.0 M_AXI_MM2S
create_bd_intf_pin -mode Master -vlnv xilinx.com:interface:aximm_rtl:1.0 M_AXI_MM2S1
create_bd_intf_pin -mode Master -vlnv xilinx.com:interface:aximm_rtl:1.0 M_AXI_S2MM
create_bd_intf_pin -mode Slave -vlnv xilinx.com:interface:aximm_rtl:1.0 S_AXI_LITE
create_bd_intf_pin -mode Slave -vlnv xilinx.com:interface:aximm_rtl:1.0 S_AXI_LITE1
create_bd_pin -dir I -type rst axi_resetn
create_bd_pin -dir O -from 5 -to 0 dout
create_bd_pin -dir I -type clk s_axi_lite_aclk

create_bd_cell -type ip -vlnv xilinx.com:ip:axi_dma:7.1 DMA_CONFIG
set_property -dict [list \
  CONFIG.c_include_mm2s 1 \
  CONFIG.c_include_s2mm 0 \
  CONFIG.c_include_sg 0 \
  CONFIG.c_m_axis_mm2s_tdata_width 32 \
  CONFIG.c_micro_dma 0 \
  CONFIG.c_mm2s_burst_size 32 \
  CONFIG.c_sg_length_width 8 \
] [get_bd_cells DMA_CONFIG]
create_bd_cell -type ip -vlnv xilinx.com:ip:axi_dma:7.1 DMA_DATA
set_property -dict [list \
  CONFIG.c_include_mm2s 1 \
  CONFIG.c_include_sg 0 \
  CONFIG.c_m_axi_mm2s_data_width 64 \
  CONFIG.c_m_axis_mm2s_tdata_width 64 \
  CONFIG.c_mm2s_burst_size 8 \
  CONFIG.c_sg_length_width 14 \
] [get_bd_cells DMA_DATA]
create_bd_cell -type ip -vlnv xilinx.com:ip:xfft:9.1 FFT
set_property -dict [list \
  CONFIG.butterfly_type use_xtremedsp_slices \
  CONFIG.channels 1 \
  CONFIG.complex_mult_type use_mults_resources \
  CONFIG.cyclic_prefix_insertion false \
  CONFIG.data_format fixed_point \
  CONFIG.implementation_options radix_4_burst_io \
  CONFIG.input_width 32 \
  CONFIG.number_of_stages_using_block_ram_for_data_and_phase_factors 0 \
  CONFIG.output_ordering natural_order \
  CONFIG.run_time_configurable_transform_length true \
  CONFIG.target_clock_frequency 100 \
  CONFIG.target_data_throughput 50 \
  CONFIG.throttle_scheme nonrealtime \
  CONFIG.transform_length 2048 \
] [get_bd_cells FFT]
create_bd_cell -type ip -vlnv xilinx.com:ip:axis_dwidth_converter:1.1 axis_dwidth_converter_0
set_property -dict {CONFIG.M_TDATA_NUM_BYTES 3} [get_bd_cells axis_dwidth_converter_0]
create_bd_cell -type ip -vlnv xilinx.com:ip:xlconcat:2.1 xlconcat_0
set_property -dict {CONFIG.NUM_PORTS 6} [get_bd_cells xlconcat_0]

# ---- hierarchy /fir_filter3 ----
current_bd_instance /fir_filter3
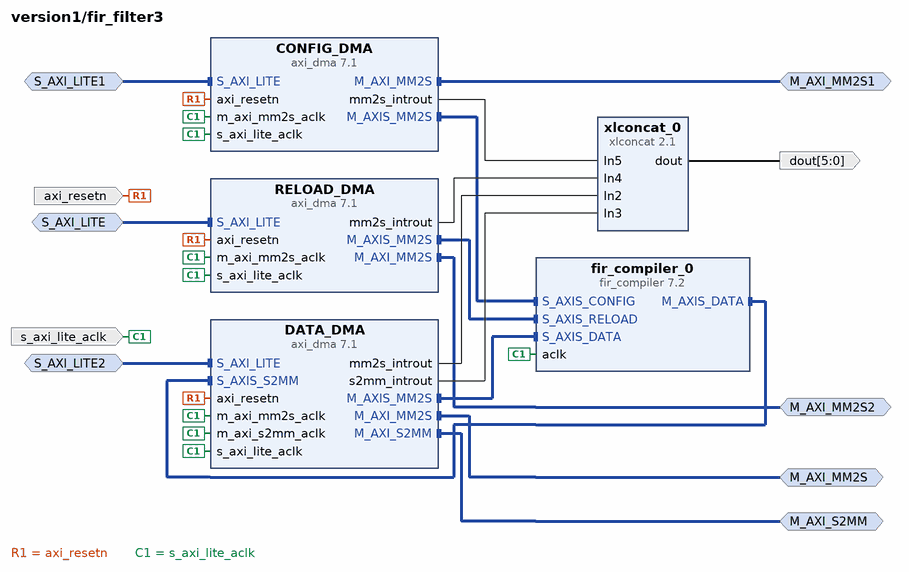
[diagram p8: block diagram inside /fir_filter3]
create_bd_intf_pin -mode Master -vlnv xilinx.com:interface:aximm_rtl:1.0 M_AXI_MM2S
create_bd_intf_pin -mode Master -vlnv xilinx.com:interface:aximm_rtl:1.0 M_AXI_MM2S1
create_bd_intf_pin -mode Master -vlnv xilinx.com:interface:aximm_rtl:1.0 M_AXI_MM2S2
create_bd_intf_pin -mode Master -vlnv xilinx.com:interface:aximm_rtl:1.0 M_AXI_S2MM
create_bd_intf_pin -mode Slave -vlnv xilinx.com:interface:aximm_rtl:1.0 S_AXI_LITE
create_bd_intf_pin -mode Slave -vlnv xilinx.com:interface:aximm_rtl:1.0 S_AXI_LITE1
create_bd_intf_pin -mode Slave -vlnv xilinx.com:interface:aximm_rtl:1.0 S_AXI_LITE2
create_bd_pin -dir I -type rst axi_resetn
create_bd_pin -dir O -from 5 -to 0 dout
create_bd_pin -dir I -type clk s_axi_lite_aclk

create_bd_cell -type ip -vlnv xilinx.com:ip:axi_dma:7.1 CONFIG_DMA
set_property -dict [list \
  CONFIG.c_include_mm2s 1 \
  CONFIG.c_include_s2mm 0 \
  CONFIG.c_include_sg 0 \
  CONFIG.c_m_axis_mm2s_tdata_width 8 \
] [get_bd_cells CONFIG_DMA]
create_bd_cell -type ip -vlnv xilinx.com:ip:axi_dma:7.1 DATA_DMA
set_property -dict [list \
  CONFIG.c_include_mm2s 1 \
  CONFIG.c_include_sg 0 \
  CONFIG.c_m_axi_mm2s_data_width 32 \
  CONFIG.c_m_axis_mm2s_tdata_width 32 \
  CONFIG.c_mm2s_burst_size 16 \
  CONFIG.c_sg_length_width 26 \
] [get_bd_cells DATA_DMA]
create_bd_cell -type ip -vlnv xilinx.com:ip:axi_dma:7.1 RELOAD_DMA
set_property -dict [list \
  CONFIG.c_include_mm2s 1 \
  CONFIG.c_include_s2mm 0 \
  CONFIG.c_include_sg 0 \
  CONFIG.c_m_axis_mm2s_tdata_width 16 \
] [get_bd_cells RELOAD_DMA]
create_bd_cell -type ip -vlnv xilinx.com:ip:fir_compiler:7.2 fir_compiler_0
set_property -dict [list \
  CONFIG.Clock_Frequency 100 \
  CONFIG.CoefficientVector {-169, -314, -507, -43, 807, 1195, 677, -195, -495, -126, 121, -191, -539, -376, -17, -46, -324, -285, 63, 172, -57, -117, 178, 359, 157, -9, 203, 422, 240, -35, 70, 314, 172, -189, -195, 83, 33, -364, -463, -133, -27, -391, -570, -188, 119, -159, -428, -45, 457, 287, -122, 154, 798, 734, 114, 141, 851, 914, 38, -332, 392, 684, -421, -1332, -601, 190, -1023, -2736, -2002, -15, -1039, -4748, -4549, 3141, 11762, 11762, 3141, -4549, -4748, -1039, -15, -2002, -2736, -1023, 190, -601, -1332, -421, 684, 392, -332, 38, 914, 851, 141, 114, 734, 798, 154, -122, 287, 457, -45, -428, -159, 119, -188, -570, -391, -27, -133, -463, -364, 33, 83, -195, -189, 172, 314, 70, -35, 240, 422, 203, -9, 157, 359, 178, -117, -57, 172, 63, -285, -324, -46, -17, -376, -539, -191, 121, -126, -495, -195, 677, 1195, 807, -43, -507, -314, -169} \
  CONFIG.Coefficient_Fractional_Bits 0 \
  CONFIG.Coefficient_Reload true \
  CONFIG.Coefficient_Sets 1 \
  CONFIG.Coefficient_Sign Signed \
  CONFIG.Coefficient_Structure Inferred \
  CONFIG.Coefficient_Width 16 \
  CONFIG.ColumnConfig 1 \
  CONFIG.DATA_Has_TLAST Packet_Framing \
  CONFIG.Data_Fractional_Bits 0 \
  CONFIG.Data_Width 32 \
  CONFIG.DisplayReloadOrder true \
  CONFIG.Filter_Architecture Systolic_Multiply_Accumulate \
  CONFIG.Gen_MIF_from_COE false \
  CONFIG.Gen_MIF_from_Spec false \
  CONFIG.Has_ARESETn true \
  CONFIG.M_DATA_Has_TREADY true \
  CONFIG.Output_Rounding_Mode Non_Symmetric_Rounding_Up \
  CONFIG.Output_Width 32 \
  CONFIG.Passband_Max 0.7 \
  CONFIG.Quantization Integer_Coefficients \
  CONFIG.Sample_Frequency 1.28E-4 \
  CONFIG.Stopband_Max .7 \
  CONFIG.Stopband_Min 0.3 \
] [get_bd_cells fir_compiler_0]
create_bd_cell -type ip -vlnv xilinx.com:ip:xlconcat:2.1 xlconcat_0
set_property -dict {CONFIG.NUM_PORTS 6} [get_bd_cells xlconcat_0]

# ---- connections ----

current_bd_instance /fft_group
connect_bd_intf_net [get_bd_intf_pins S_AXI_LITE1] [get_bd_intf_pins DMA_CONFIG/S_AXI_LITE]
connect_bd_intf_net [get_bd_intf_pins M_AXI_S2MM] [get_bd_intf_pins DMA_DATA/M_AXI_S2MM]
connect_bd_intf_net [get_bd_intf_pins M_AXI_MM2S1] [get_bd_intf_pins DMA_CONFIG/M_AXI_MM2S]
connect_bd_intf_net [get_bd_intf_pins S_AXI_LITE] [get_bd_intf_pins DMA_DATA/S_AXI_LITE]
connect_bd_intf_net [get_bd_intf_pins DMA_CONFIG/M_AXIS_MM2S] [get_bd_intf_pins axis_dwidth_converter_0/S_AXIS]
connect_bd_intf_net [get_bd_intf_pins FFT/S_AXIS_CONFIG] [get_bd_intf_pins axis_dwidth_converter_0/M_AXIS]
connect_bd_intf_net [get_bd_intf_pins DMA_DATA/S_AXIS_S2MM] [get_bd_intf_pins FFT/M_AXIS_DATA]
connect_bd_intf_net [get_bd_intf_pins DMA_DATA/M_AXIS_MM2S] [get_bd_intf_pins FFT/S_AXIS_DATA]
connect_bd_intf_net [get_bd_intf_pins M_AXI_MM2S] [get_bd_intf_pins DMA_DATA/M_AXI_MM2S]
connect_bd_net [get_bd_pins DMA_DATA/mm2s_introut] [get_bd_pins xlconcat_0/In2]
connect_bd_net [get_bd_pins DMA_DATA/s2mm_introut] [get_bd_pins xlconcat_0/In3]
connect_bd_net [get_bd_pins FFT/event_data_in_channel_halt] [get_bd_pins xlconcat_0/In0]
connect_bd_net [get_bd_pins FFT/event_frame_started] [get_bd_pins xlconcat_0/In4]
connect_bd_net [get_bd_pins FFT/event_tlast_missing] [get_bd_pins xlconcat_0/In5]
connect_bd_net [get_bd_pins FFT/event_tlast_unexpected] [get_bd_pins xlconcat_0/In1]
connect_bd_net -net processing_system7_0_FCLK_CLK0 [get_bd_pins s_axi_lite_aclk] \
  [get_bd_pins DMA_CONFIG/m_axi_mm2s_aclk] [get_bd_pins DMA_CONFIG/s_axi_lite_aclk] [get_bd_pins DMA_DATA/m_axi_mm2s_aclk] \
  [get_bd_pins DMA_DATA/m_axi_s2mm_aclk] [get_bd_pins DMA_DATA/s_axi_lite_aclk] [get_bd_pins FFT/aclk] \
  [get_bd_pins axis_dwidth_converter_0/aclk]
connect_bd_net -net rst_ps7_0_100M_peripheral_aresetn [get_bd_pins axi_resetn] \
  [get_bd_pins DMA_CONFIG/axi_resetn] [get_bd_pins DMA_DATA/axi_resetn] [get_bd_pins axis_dwidth_converter_0/aresetn]
connect_bd_net [get_bd_pins xlconcat_0/dout] [get_bd_pins dout]

current_bd_instance /fir_filter
connect_bd_intf_net [get_bd_intf_pins S_AXI_LITE2] [get_bd_intf_pins DATA_DMA/S_AXI_LITE]
connect_bd_intf_net [get_bd_intf_pins S_AXI_LITE1] [get_bd_intf_pins CONFIG_DMA/S_AXI_LITE]
connect_bd_intf_net [get_bd_intf_pins DATA_DMA/M_AXIS_MM2S] [get_bd_intf_pins fir_compiler_0/S_AXIS_DATA]
connect_bd_intf_net [get_bd_intf_pins DATA_DMA/S_AXIS_S2MM] [get_bd_intf_pins fir_compiler_0/M_AXIS_DATA]
connect_bd_intf_net [get_bd_intf_pins M_AXI_MM2S] [get_bd_intf_pins DATA_DMA/M_AXI_MM2S]
connect_bd_intf_net [get_bd_intf_pins M_AXI_S2MM] [get_bd_intf_pins DATA_DMA/M_AXI_S2MM]
connect_bd_intf_net [get_bd_intf_pins M_AXI_MM2S1] [get_bd_intf_pins CONFIG_DMA/M_AXI_MM2S]
connect_bd_intf_net [get_bd_intf_pins M_AXI_MM2S2] [get_bd_intf_pins RELOAD_DMA/M_AXI_MM2S]
connect_bd_intf_net [get_bd_intf_pins CONFIG_DMA/M_AXIS_MM2S] [get_bd_intf_pins fir_compiler_0/S_AXIS_CONFIG]
connect_bd_intf_net [get_bd_intf_pins RELOAD_DMA/M_AXIS_MM2S] [get_bd_intf_pins fir_compiler_0/S_AXIS_RELOAD]
connect_bd_intf_net [get_bd_intf_pins S_AXI_LITE] [get_bd_intf_pins RELOAD_DMA/S_AXI_LITE]
connect_bd_net [get_bd_pins CONFIG_DMA/mm2s_introut] [get_bd_pins xlconcat_0/In5]
connect_bd_net [get_bd_pins DATA_DMA/mm2s_introut] [get_bd_pins xlconcat_0/In2]
connect_bd_net [get_bd_pins DATA_DMA/s2mm_introut] [get_bd_pins xlconcat_0/In3]
connect_bd_net [get_bd_pins RELOAD_DMA/mm2s_introut] [get_bd_pins xlconcat_0/In4]
connect_bd_net [get_bd_pins axi_resetn] [get_bd_pins CONFIG_DMA/axi_resetn] [get_bd_pins DATA_DMA/axi_resetn] [get_bd_pins RELOAD_DMA/axi_resetn]
connect_bd_net [get_bd_pins s_axi_lite_aclk] \
  [get_bd_pins CONFIG_DMA/m_axi_mm2s_aclk] [get_bd_pins CONFIG_DMA/s_axi_lite_aclk] [get_bd_pins DATA_DMA/m_axi_mm2s_aclk] \
  [get_bd_pins DATA_DMA/m_axi_s2mm_aclk] [get_bd_pins DATA_DMA/s_axi_lite_aclk] [get_bd_pins RELOAD_DMA/m_axi_mm2s_aclk] \
  [get_bd_pins RELOAD_DMA/s_axi_lite_aclk] [get_bd_pins fir_compiler_0/aclk]
connect_bd_net [get_bd_pins xlconcat_0/dout] [get_bd_pins dout]

current_bd_instance /fft_group1
connect_bd_intf_net [get_bd_intf_pins M_AXI_MM2S1] [get_bd_intf_pins DMA_CONFIG/M_AXI_MM2S]
connect_bd_intf_net [get_bd_intf_pins DMA_DATA/S_AXIS_S2MM] [get_bd_intf_pins FFT/M_AXIS_DATA]
connect_bd_intf_net [get_bd_intf_pins S_AXI_LITE] [get_bd_intf_pins DMA_DATA/S_AXI_LITE]
connect_bd_intf_net [get_bd_intf_pins FFT/S_AXIS_CONFIG] [get_bd_intf_pins axis_dwidth_converter_0/M_AXIS]
connect_bd_intf_net [get_bd_intf_pins DMA_DATA/M_AXIS_MM2S] [get_bd_intf_pins FFT/S_AXIS_DATA]
connect_bd_intf_net [get_bd_intf_pins S_AXI_LITE1] [get_bd_intf_pins DMA_CONFIG/S_AXI_LITE]
connect_bd_intf_net [get_bd_intf_pins M_AXI_MM2S] [get_bd_intf_pins DMA_DATA/M_AXI_MM2S]
connect_bd_intf_net [get_bd_intf_pins M_AXI_S2MM] [get_bd_intf_pins DMA_DATA/M_AXI_S2MM]
connect_bd_intf_net [get_bd_intf_pins DMA_CONFIG/M_AXIS_MM2S] [get_bd_intf_pins axis_dwidth_converter_0/S_AXIS]
connect_bd_net [get_bd_pins DMA_DATA/mm2s_introut] [get_bd_pins xlconcat_0/In2]
connect_bd_net [get_bd_pins DMA_DATA/s2mm_introut] [get_bd_pins xlconcat_0/In3]
connect_bd_net [get_bd_pins FFT/event_data_in_channel_halt] [get_bd_pins xlconcat_0/In0]
connect_bd_net [get_bd_pins FFT/event_frame_started] [get_bd_pins xlconcat_0/In4]
connect_bd_net [get_bd_pins FFT/event_tlast_missing] [get_bd_pins xlconcat_0/In5]
connect_bd_net [get_bd_pins FFT/event_tlast_unexpected] [get_bd_pins xlconcat_0/In1]
connect_bd_net -net processing_system7_0_FCLK_CLK0 [get_bd_pins s_axi_lite_aclk] \
  [get_bd_pins DMA_CONFIG/m_axi_mm2s_aclk] [get_bd_pins DMA_CONFIG/s_axi_lite_aclk] [get_bd_pins DMA_DATA/m_axi_mm2s_aclk] \
  [get_bd_pins DMA_DATA/m_axi_s2mm_aclk] [get_bd_pins DMA_DATA/s_axi_lite_aclk] [get_bd_pins FFT/aclk] \
  [get_bd_pins axis_dwidth_converter_0/aclk]
connect_bd_net -net rst_ps7_0_100M_peripheral_aresetn [get_bd_pins axi_resetn] \
  [get_bd_pins DMA_CONFIG/axi_resetn] [get_bd_pins DMA_DATA/axi_resetn] [get_bd_pins axis_dwidth_converter_0/aresetn]
connect_bd_net [get_bd_pins xlconcat_0/dout] [get_bd_pins dout]

current_bd_instance /fir_filter1
connect_bd_intf_net [get_bd_intf_pins S_AXI_LITE] [get_bd_intf_pins RELOAD_DMA/S_AXI_LITE]
connect_bd_intf_net [get_bd_intf_pins S_AXI_LITE1] [get_bd_intf_pins CONFIG_DMA/S_AXI_LITE]
connect_bd_intf_net [get_bd_intf_pins S_AXI_LITE2] [get_bd_intf_pins DATA_DMA/S_AXI_LITE]
connect_bd_intf_net [get_bd_intf_pins CONFIG_DMA/M_AXIS_MM2S] [get_bd_intf_pins fir_compiler_0/S_AXIS_CONFIG]
connect_bd_intf_net [get_bd_intf_pins M_AXI_MM2S] [get_bd_intf_pins DATA_DMA/M_AXI_MM2S]
connect_bd_intf_net [get_bd_intf_pins M_AXI_S2MM] [get_bd_intf_pins DATA_DMA/M_AXI_S2MM]
connect_bd_intf_net [get_bd_intf_pins DATA_DMA/S_AXIS_S2MM] [get_bd_intf_pins fir_compiler_0/M_AXIS_DATA]
connect_bd_intf_net [get_bd_intf_pins M_AXI_MM2S2] [get_bd_intf_pins RELOAD_DMA/M_AXI_MM2S]
connect_bd_intf_net [get_bd_intf_pins RELOAD_DMA/M_AXIS_MM2S] [get_bd_intf_pins fir_compiler_0/S_AXIS_RELOAD]
connect_bd_intf_net [get_bd_intf_pins DATA_DMA/M_AXIS_MM2S] [get_bd_intf_pins fir_compiler_0/S_AXIS_DATA]
connect_bd_intf_net [get_bd_intf_pins M_AXI_MM2S1] [get_bd_intf_pins CONFIG_DMA/M_AXI_MM2S]
connect_bd_net [get_bd_pins CONFIG_DMA/mm2s_introut] [get_bd_pins xlconcat_0/In5]
connect_bd_net [get_bd_pins DATA_DMA/mm2s_introut] [get_bd_pins xlconcat_0/In2]
connect_bd_net [get_bd_pins DATA_DMA/s2mm_introut] [get_bd_pins xlconcat_0/In3]
connect_bd_net [get_bd_pins RELOAD_DMA/mm2s_introut] [get_bd_pins xlconcat_0/In4]
connect_bd_net [get_bd_pins axi_resetn] [get_bd_pins CONFIG_DMA/axi_resetn] [get_bd_pins DATA_DMA/axi_resetn] [get_bd_pins RELOAD_DMA/axi_resetn]
connect_bd_net [get_bd_pins s_axi_lite_aclk] \
  [get_bd_pins CONFIG_DMA/m_axi_mm2s_aclk] [get_bd_pins CONFIG_DMA/s_axi_lite_aclk] [get_bd_pins DATA_DMA/m_axi_mm2s_aclk] \
  [get_bd_pins DATA_DMA/m_axi_s2mm_aclk] [get_bd_pins DATA_DMA/s_axi_lite_aclk] [get_bd_pins RELOAD_DMA/m_axi_mm2s_aclk] \
  [get_bd_pins RELOAD_DMA/s_axi_lite_aclk] [get_bd_pins fir_compiler_0/aclk]
connect_bd_net [get_bd_pins xlconcat_0/dout] [get_bd_pins dout]

current_bd_instance /fft_group2
connect_bd_intf_net [get_bd_intf_pins M_AXI_MM2S1] [get_bd_intf_pins DMA_CONFIG/M_AXI_MM2S]
connect_bd_intf_net [get_bd_intf_pins S_AXI_LITE1] [get_bd_intf_pins DMA_CONFIG/S_AXI_LITE]
connect_bd_intf_net [get_bd_intf_pins DMA_DATA/M_AXIS_MM2S] [get_bd_intf_pins FFT/S_AXIS_DATA]
connect_bd_intf_net [get_bd_intf_pins DMA_CONFIG/M_AXIS_MM2S] [get_bd_intf_pins axis_dwidth_converter_0/S_AXIS]
connect_bd_intf_net [get_bd_intf_pins S_AXI_LITE] [get_bd_intf_pins DMA_DATA/S_AXI_LITE]
connect_bd_intf_net [get_bd_intf_pins M_AXI_S2MM] [get_bd_intf_pins DMA_DATA/M_AXI_S2MM]
connect_bd_intf_net [get_bd_intf_pins FFT/S_AXIS_CONFIG] [get_bd_intf_pins axis_dwidth_converter_0/M_AXIS]
connect_bd_intf_net [get_bd_intf_pins DMA_DATA/S_AXIS_S2MM] [get_bd_intf_pins FFT/M_AXIS_DATA]
connect_bd_intf_net [get_bd_intf_pins M_AXI_MM2S] [get_bd_intf_pins DMA_DATA/M_AXI_MM2S]
connect_bd_net [get_bd_pins DMA_DATA/mm2s_introut] [get_bd_pins xlconcat_0/In2]
connect_bd_net [get_bd_pins DMA_DATA/s2mm_introut] [get_bd_pins xlconcat_0/In3]
connect_bd_net [get_bd_pins FFT/event_data_in_channel_halt] [get_bd_pins xlconcat_0/In0]
connect_bd_net [get_bd_pins FFT/event_frame_started] [get_bd_pins xlconcat_0/In4]
connect_bd_net [get_bd_pins FFT/event_tlast_missing] [get_bd_pins xlconcat_0/In5]
connect_bd_net [get_bd_pins FFT/event_tlast_unexpected] [get_bd_pins xlconcat_0/In1]
connect_bd_net -net processing_system7_0_FCLK_CLK0 [get_bd_pins s_axi_lite_aclk] \
  [get_bd_pins DMA_CONFIG/m_axi_mm2s_aclk] [get_bd_pins DMA_CONFIG/s_axi_lite_aclk] [get_bd_pins DMA_DATA/m_axi_mm2s_aclk] \
  [get_bd_pins DMA_DATA/m_axi_s2mm_aclk] [get_bd_pins DMA_DATA/s_axi_lite_aclk] [get_bd_pins FFT/aclk] \
  [get_bd_pins axis_dwidth_converter_0/aclk]
connect_bd_net -net rst_ps7_0_100M_peripheral_aresetn [get_bd_pins axi_resetn] \
  [get_bd_pins DMA_CONFIG/axi_resetn] [get_bd_pins DMA_DATA/axi_resetn] [get_bd_pins axis_dwidth_converter_0/aresetn]
connect_bd_net [get_bd_pins xlconcat_0/dout] [get_bd_pins dout]

current_bd_instance /fir_filter2
connect_bd_intf_net [get_bd_intf_pins S_AXI_LITE2] [get_bd_intf_pins DATA_DMA/S_AXI_LITE]
connect_bd_intf_net [get_bd_intf_pins CONFIG_DMA/M_AXIS_MM2S] [get_bd_intf_pins fir_compiler_0/S_AXIS_CONFIG]
connect_bd_intf_net [get_bd_intf_pins M_AXI_S2MM] [get_bd_intf_pins DATA_DMA/M_AXI_S2MM]
connect_bd_intf_net [get_bd_intf_pins M_AXI_MM2S2] [get_bd_intf_pins RELOAD_DMA/M_AXI_MM2S]
connect_bd_intf_net [get_bd_intf_pins DATA_DMA/M_AXIS_MM2S] [get_bd_intf_pins fir_compiler_0/S_AXIS_DATA]
connect_bd_intf_net [get_bd_intf_pins M_AXI_MM2S1] [get_bd_intf_pins CONFIG_DMA/M_AXI_MM2S]
connect_bd_intf_net [get_bd_intf_pins DATA_DMA/S_AXIS_S2MM] [get_bd_intf_pins fir_compiler_0/M_AXIS_DATA]
connect_bd_intf_net [get_bd_intf_pins M_AXI_MM2S] [get_bd_intf_pins DATA_DMA/M_AXI_MM2S]
connect_bd_intf_net [get_bd_intf_pins RELOAD_DMA/M_AXIS_MM2S] [get_bd_intf_pins fir_compiler_0/S_AXIS_RELOAD]
connect_bd_intf_net [get_bd_intf_pins S_AXI_LITE1] [get_bd_intf_pins CONFIG_DMA/S_AXI_LITE]
connect_bd_intf_net [get_bd_intf_pins S_AXI_LITE] [get_bd_intf_pins RELOAD_DMA/S_AXI_LITE]
connect_bd_net [get_bd_pins CONFIG_DMA/mm2s_introut] [get_bd_pins xlconcat_0/In5]
connect_bd_net [get_bd_pins DATA_DMA/mm2s_introut] [get_bd_pins xlconcat_0/In2]
connect_bd_net [get_bd_pins DATA_DMA/s2mm_introut] [get_bd_pins xlconcat_0/In3]
connect_bd_net [get_bd_pins RELOAD_DMA/mm2s_introut] [get_bd_pins xlconcat_0/In4]
connect_bd_net [get_bd_pins axi_resetn] [get_bd_pins CONFIG_DMA/axi_resetn] [get_bd_pins DATA_DMA/axi_resetn] [get_bd_pins RELOAD_DMA/axi_resetn]
connect_bd_net [get_bd_pins s_axi_lite_aclk] \
  [get_bd_pins CONFIG_DMA/m_axi_mm2s_aclk] [get_bd_pins CONFIG_DMA/s_axi_lite_aclk] [get_bd_pins DATA_DMA/m_axi_mm2s_aclk] \
  [get_bd_pins DATA_DMA/m_axi_s2mm_aclk] [get_bd_pins DATA_DMA/s_axi_lite_aclk] [get_bd_pins RELOAD_DMA/m_axi_mm2s_aclk] \
  [get_bd_pins RELOAD_DMA/s_axi_lite_aclk] [get_bd_pins fir_compiler_0/aclk]
connect_bd_net [get_bd_pins xlconcat_0/dout] [get_bd_pins dout]

current_bd_instance /fft_group3
connect_bd_intf_net [get_bd_intf_pins S_AXI_LITE] [get_bd_intf_pins DMA_DATA/S_AXI_LITE]
connect_bd_intf_net [get_bd_intf_pins DMA_DATA/S_AXIS_S2MM] [get_bd_intf_pins FFT/M_AXIS_DATA]
connect_bd_intf_net [get_bd_intf_pins M_AXI_S2MM] [get_bd_intf_pins DMA_DATA/M_AXI_S2MM]
connect_bd_intf_net [get_bd_intf_pins S_AXI_LITE1] [get_bd_intf_pins DMA_CONFIG/S_AXI_LITE]
connect_bd_intf_net [get_bd_intf_pins FFT/S_AXIS_CONFIG] [get_bd_intf_pins axis_dwidth_converter_0/M_AXIS]
connect_bd_intf_net [get_bd_intf_pins DMA_DATA/M_AXIS_MM2S] [get_bd_intf_pins FFT/S_AXIS_DATA]
connect_bd_intf_net [get_bd_intf_pins M_AXI_MM2S1] [get_bd_intf_pins DMA_CONFIG/M_AXI_MM2S]
connect_bd_intf_net [get_bd_intf_pins DMA_CONFIG/M_AXIS_MM2S] [get_bd_intf_pins axis_dwidth_converter_0/S_AXIS]
connect_bd_intf_net [get_bd_intf_pins M_AXI_MM2S] [get_bd_intf_pins DMA_DATA/M_AXI_MM2S]
connect_bd_net [get_bd_pins DMA_DATA/mm2s_introut] [get_bd_pins xlconcat_0/In2]
connect_bd_net [get_bd_pins DMA_DATA/s2mm_introut] [get_bd_pins xlconcat_0/In3]
connect_bd_net [get_bd_pins FFT/event_data_in_channel_halt] [get_bd_pins xlconcat_0/In0]
connect_bd_net [get_bd_pins FFT/event_frame_started] [get_bd_pins xlconcat_0/In4]
connect_bd_net [get_bd_pins FFT/event_tlast_missing] [get_bd_pins xlconcat_0/In5]
connect_bd_net [get_bd_pins FFT/event_tlast_unexpected] [get_bd_pins xlconcat_0/In1]
connect_bd_net -net processing_system7_0_FCLK_CLK0 [get_bd_pins s_axi_lite_aclk] \
  [get_bd_pins DMA_CONFIG/m_axi_mm2s_aclk] [get_bd_pins DMA_CONFIG/s_axi_lite_aclk] [get_bd_pins DMA_DATA/m_axi_mm2s_aclk] \
  [get_bd_pins DMA_DATA/m_axi_s2mm_aclk] [get_bd_pins DMA_DATA/s_axi_lite_aclk] [get_bd_pins FFT/aclk] \
  [get_bd_pins axis_dwidth_converter_0/aclk]
connect_bd_net -net rst_ps7_0_100M_peripheral_aresetn [get_bd_pins axi_resetn] \
  [get_bd_pins DMA_CONFIG/axi_resetn] [get_bd_pins DMA_DATA/axi_resetn] [get_bd_pins axis_dwidth_converter_0/aresetn]
connect_bd_net [get_bd_pins xlconcat_0/dout] [get_bd_pins dout]

current_bd_instance /fir_filter3
connect_bd_intf_net [get_bd_intf_pins S_AXI_LITE] [get_bd_intf_pins RELOAD_DMA/S_AXI_LITE]
connect_bd_intf_net [get_bd_intf_pins S_AXI_LITE1] [get_bd_intf_pins CONFIG_DMA/S_AXI_LITE]
connect_bd_intf_net [get_bd_intf_pins CONFIG_DMA/M_AXIS_MM2S] [get_bd_intf_pins fir_compiler_0/S_AXIS_CONFIG]
connect_bd_intf_net [get_bd_intf_pins M_AXI_S2MM] [get_bd_intf_pins DATA_DMA/M_AXI_S2MM]
connect_bd_intf_net [get_bd_intf_pins S_AXI_LITE2] [get_bd_intf_pins DATA_DMA/S_AXI_LITE]
connect_bd_intf_net [get_bd_intf_pins M_AXI_MM2S1] [get_bd_intf_pins CONFIG_DMA/M_AXI_MM2S]
connect_bd_intf_net [get_bd_intf_pins M_AXI_MM2S] [get_bd_intf_pins DATA_DMA/M_AXI_MM2S]
connect_bd_intf_net [get_bd_intf_pins DATA_DMA/S_AXIS_S2MM] [get_bd_intf_pins fir_compiler_0/M_AXIS_DATA]
connect_bd_intf_net [get_bd_intf_pins DATA_DMA/M_AXIS_MM2S] [get_bd_intf_pins fir_compiler_0/S_AXIS_DATA]
connect_bd_intf_net [get_bd_intf_pins RELOAD_DMA/M_AXIS_MM2S] [get_bd_intf_pins fir_compiler_0/S_AXIS_RELOAD]
connect_bd_intf_net [get_bd_intf_pins M_AXI_MM2S2] [get_bd_intf_pins RELOAD_DMA/M_AXI_MM2S]
connect_bd_net [get_bd_pins CONFIG_DMA/mm2s_introut] [get_bd_pins xlconcat_0/In5]
connect_bd_net [get_bd_pins DATA_DMA/mm2s_introut] [get_bd_pins xlconcat_0/In2]
connect_bd_net [get_bd_pins DATA_DMA/s2mm_introut] [get_bd_pins xlconcat_0/In3]
connect_bd_net [get_bd_pins RELOAD_DMA/mm2s_introut] [get_bd_pins xlconcat_0/In4]
connect_bd_net [get_bd_pins axi_resetn] [get_bd_pins CONFIG_DMA/axi_resetn] [get_bd_pins DATA_DMA/axi_resetn] [get_bd_pins RELOAD_DMA/axi_resetn]
connect_bd_net [get_bd_pins s_axi_lite_aclk] \
  [get_bd_pins CONFIG_DMA/m_axi_mm2s_aclk] [get_bd_pins CONFIG_DMA/s_axi_lite_aclk] [get_bd_pins DATA_DMA/m_axi_mm2s_aclk] \
  [get_bd_pins DATA_DMA/m_axi_s2mm_aclk] [get_bd_pins DATA_DMA/s_axi_lite_aclk] [get_bd_pins RELOAD_DMA/m_axi_mm2s_aclk] \
  [get_bd_pins RELOAD_DMA/s_axi_lite_aclk] [get_bd_pins fir_compiler_0/aclk]
connect_bd_net [get_bd_pins xlconcat_0/dout] [get_bd_pins dout]
